# Altium schematic sheet adc-circit-ADS7952.SchDoc
size A4
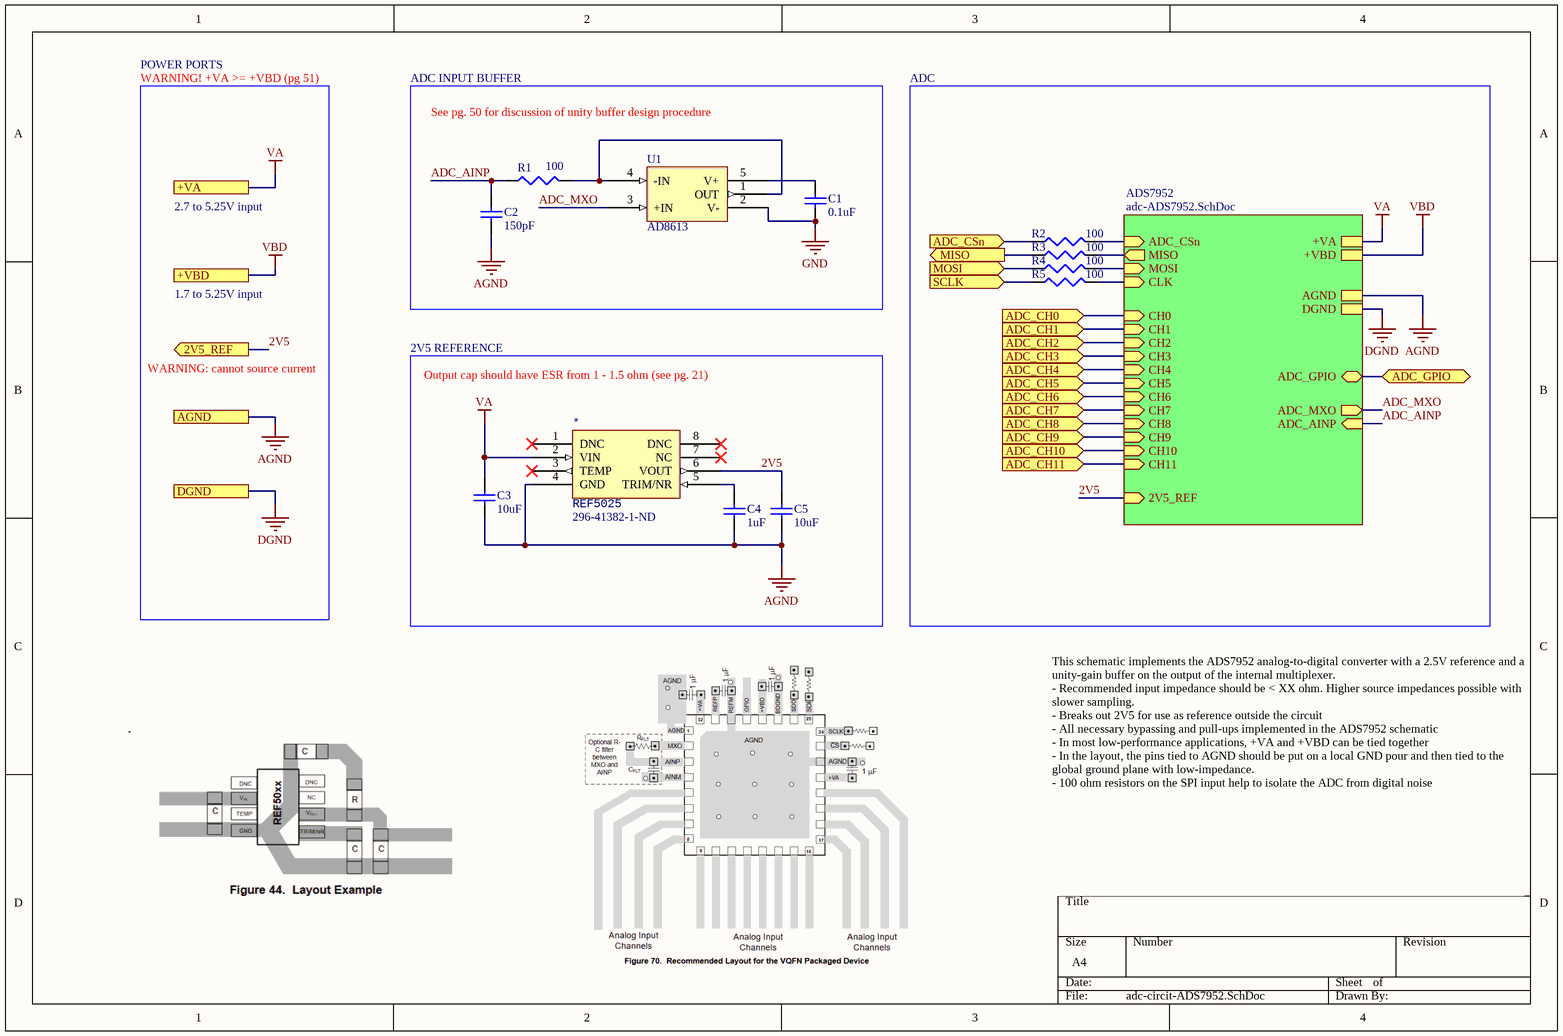
[diagram p0: adc-circit-ADS7952.SchDoc]

## Parts
*  REF5025  Supplier Part Number 1: 296-41382-1-ND  [SOP65P300X125-8N]
C1  0.1uF  [C1206]
C2  150pF  [C1206]
C3  10uF  [RAD-0.3]
C4  1uF  [RAD-0.3]
C5  10uF  [RAD-0.3]
R1  100  [J1-0603]
R2  100  [J1-0603]
R3  100  [J1-0603]
R4  100  [J1-0603]
R5  100  [J1-0603]
U1  AD8613  [SOP65P200X125-5N]

## Blocks framed on the sheet
ADC: R2-R5

## Sub-sheets
ADS7952 = adc-ADS7952.SchDoc: CH8 (in), CH2 (in), CH11 (in), CH10 (in), CH9 (in), CH6 (in), CH3 (in), CH7 (in), CH5 (in), CH4 (in), CH0 (in), CH1 (in), +VA, DGND, +VBD, AGND, CLK (in), MISO (out), MOSI (in), ADC_CSn (in), ADC_GPIO (bidir), ADC_AINP (in), 2V5_REF (in), ADC_MXO (out)

## Ports
2V5_REF (out), +VA, +VBD, ADC_CH0 (in), ADC_CH1 (in), ADC_CH2 (in), ADC_CH3 (in), ADC_CH4 (in), ADC_CH5 (in), ADC_CH6 (in), ADC_CH7 (in), ADC_CH8 (in), ADC_CH9 (in), ADC_CH10 (in), ADC_CH11 (in), ADC_CSn (in), ADC_GPIO (bidir), AGND, DGND, MISO (out), MOSI (in), SCLK (in)

## Nets
AGND: *.4(GND) C2.1 C3.1 C4.1 C5.1 ; port AGND, sheet ADS7952/AGND
DGND: port DGND, sheet ADS7952/DGND
GND: C1.2 U1.2(V-)
VA: *.2(VIN) C3.2 ; port +VA, sheet ADS7952/+VA
VBD: port +VBD, sheet ADS7952/+VBD
2V5: *.6(VOUT) C5.2 ; port 2V5_REF, sheet ADS7952/2V5_REF
ADC_AINP: C2.2 R1.1 ; sheet ADS7952/ADC_AINP
ADC_CH0: port ADC_CH0, sheet ADS7952/CH0
ADC_CH1: port ADC_CH1, sheet ADS7952/CH1
ADC_CH2: port ADC_CH2, sheet ADS7952/CH2
ADC_CH3: port ADC_CH3, sheet ADS7952/CH3
ADC_CH4: port ADC_CH4, sheet ADS7952/CH4
ADC_CH5: port ADC_CH5, sheet ADS7952/CH5
ADC_CH6: port ADC_CH6, sheet ADS7952/CH6
ADC_CH7: port ADC_CH7, sheet ADS7952/CH7
ADC_CH8: port ADC_CH8, sheet ADS7952/CH8
ADC_CH9: port ADC_CH9, sheet ADS7952/CH9
ADC_CH10: port ADC_CH10, sheet ADS7952/CH10
ADC_CH11: port ADC_CH11, sheet ADS7952/CH11
ADC_CSn: R2.1 ; port ADC_CSn
ADC_GPIO: port ADC_GPIO, sheet ADS7952/ADC_GPIO
ADC_MXO: U1.3(+IN) ; sheet ADS7952/ADC_MXO
MISO: R3.1 ; port MISO
MOSI: R4.1 ; port MOSI
SCLK: R5.1 ; port SCLK
Net*_5: *.5(TRIM/NR) C4.2
NetC1_1: C1.1 U1.5(V+)
NetR1_2: R1.2 U1.1(OUT) U1.4(-IN)
NetR2_2: R2.2 ; sheet ADS7952/ADC_CSn
NetR3_2: R3.2 ; sheet ADS7952/MISO
NetR4_2: R4.2 ; sheet ADS7952/MOSI
NetR5_2: R5.2 ; sheet ADS7952/CLK

Not connected (* = marked no-connect by the designer): * 1(DNC)* 3(TEMP)* 7(NC)* 8(DNC)*

## Notes on the sheet
- POWER PORTS
- WARNING! +VA >= +VBD (pg 51)
- ADC INPUT BUFFER
- See pg. 50 for discussion of unity buffer design procedure
- 2.7 to 5.25V input
- 1.7 to 5.25V input
- WARNING: cannot source current
- 2V5 REFERENCE
- Output cap should have ESR from 1 - 1.5 ohm (see pg. 21)
- This schematic implements the ADS7952 analog-to-digital converter with a 2.5V reference and a unity-gain buffer on the output of the internal multiplexer.
  - Recommended input impedance should be < XX ohm. Higher source impedances possible with slower sampling.
  - Breaks out 2V5 for use as reference outside the circuit
  - All necessary bypassing and pull-ups implemented in the ADS7952 schematic
  - In most low-performance applications, +VA and +VBD can be tied together
  - In the layout, the pins tied to AGND should be put on a local GND pour and then tied to the global ground plane with low-impedance.
  - 100 ohm resistors on the SPI input help to isolate the ADC from digital noise

## Library data of the parts
* = REF5025: Voltage Reference; Supplier 1: Digi-Key
C1 C2 = Cap Semi: Capacitor (Semiconductor SIM Model); Published: 8-Jun-2000; LatestRevisionDate: 29-May-2009; LatestRevisionNote: IPC-7351 Footprint Added.; PackageReference: C1206; Publisher: Altium Limited; PackageDescription: Chip Capacitor
  C1: Value: 0.1uF
  C2: Value: 150pF
C3 C4 = Cap: Capacitor; Published: 8-Jun-2000; LatestRevisionDate: 17-Jul-2002; LatestRevisionNote: Re-released for DXP Platform.; PackageReference: RAD-0.3; Publisher: Altium Limited; PackageDescription: Radial Cap, Thru-Hole; 2 Leads; 0.3 in Pin Spacing
  C3: Value: 10uF
  C4: Value: 1uF
C5 = Cap: ESR between 1-1.5 ohm; Published: 8-Jun-2000; LatestRevisionDate: 17-Jul-2002; LatestRevisionNote: Re-released for DXP Platform.; PackageReference: RAD-0.3; Publisher: Altium Limited; PackageDescription: Radial Cap, Thru-Hole; 2 Leads; 0.3 in Pin Spacing; Value: 10uF
R1-R5 = Res3: Resistor; Published: 8-Jun-2000; LatestRevisionDate: 29-May-2009; LatestRevisionNote: IPC-7351 Footprint Added.; PackageReference: J1-0603; Publisher: Altium Limited; PackageDescription: Chip Resistor; Value: 100
U1 = AD8613: Low power, low noise rail-to-rail op-amp.; Supplier 1: Digi-Key; Supplier Part Number 1: AD8613AKSZ-REEL7CT-ND